# Altium schematic sheet PATHOS_FPGA_IO.SchDoc: FPGA IO
size A3; Author: A. Kalberer; CompanyName: NTB; Organization: NTB Interstate University of Applied; Address1: Werdenbergstrasse 4; Address3: 9471 Buchs; Address4: Switzerland; Organization1: Sciences of Technology Buchs; Size: A3
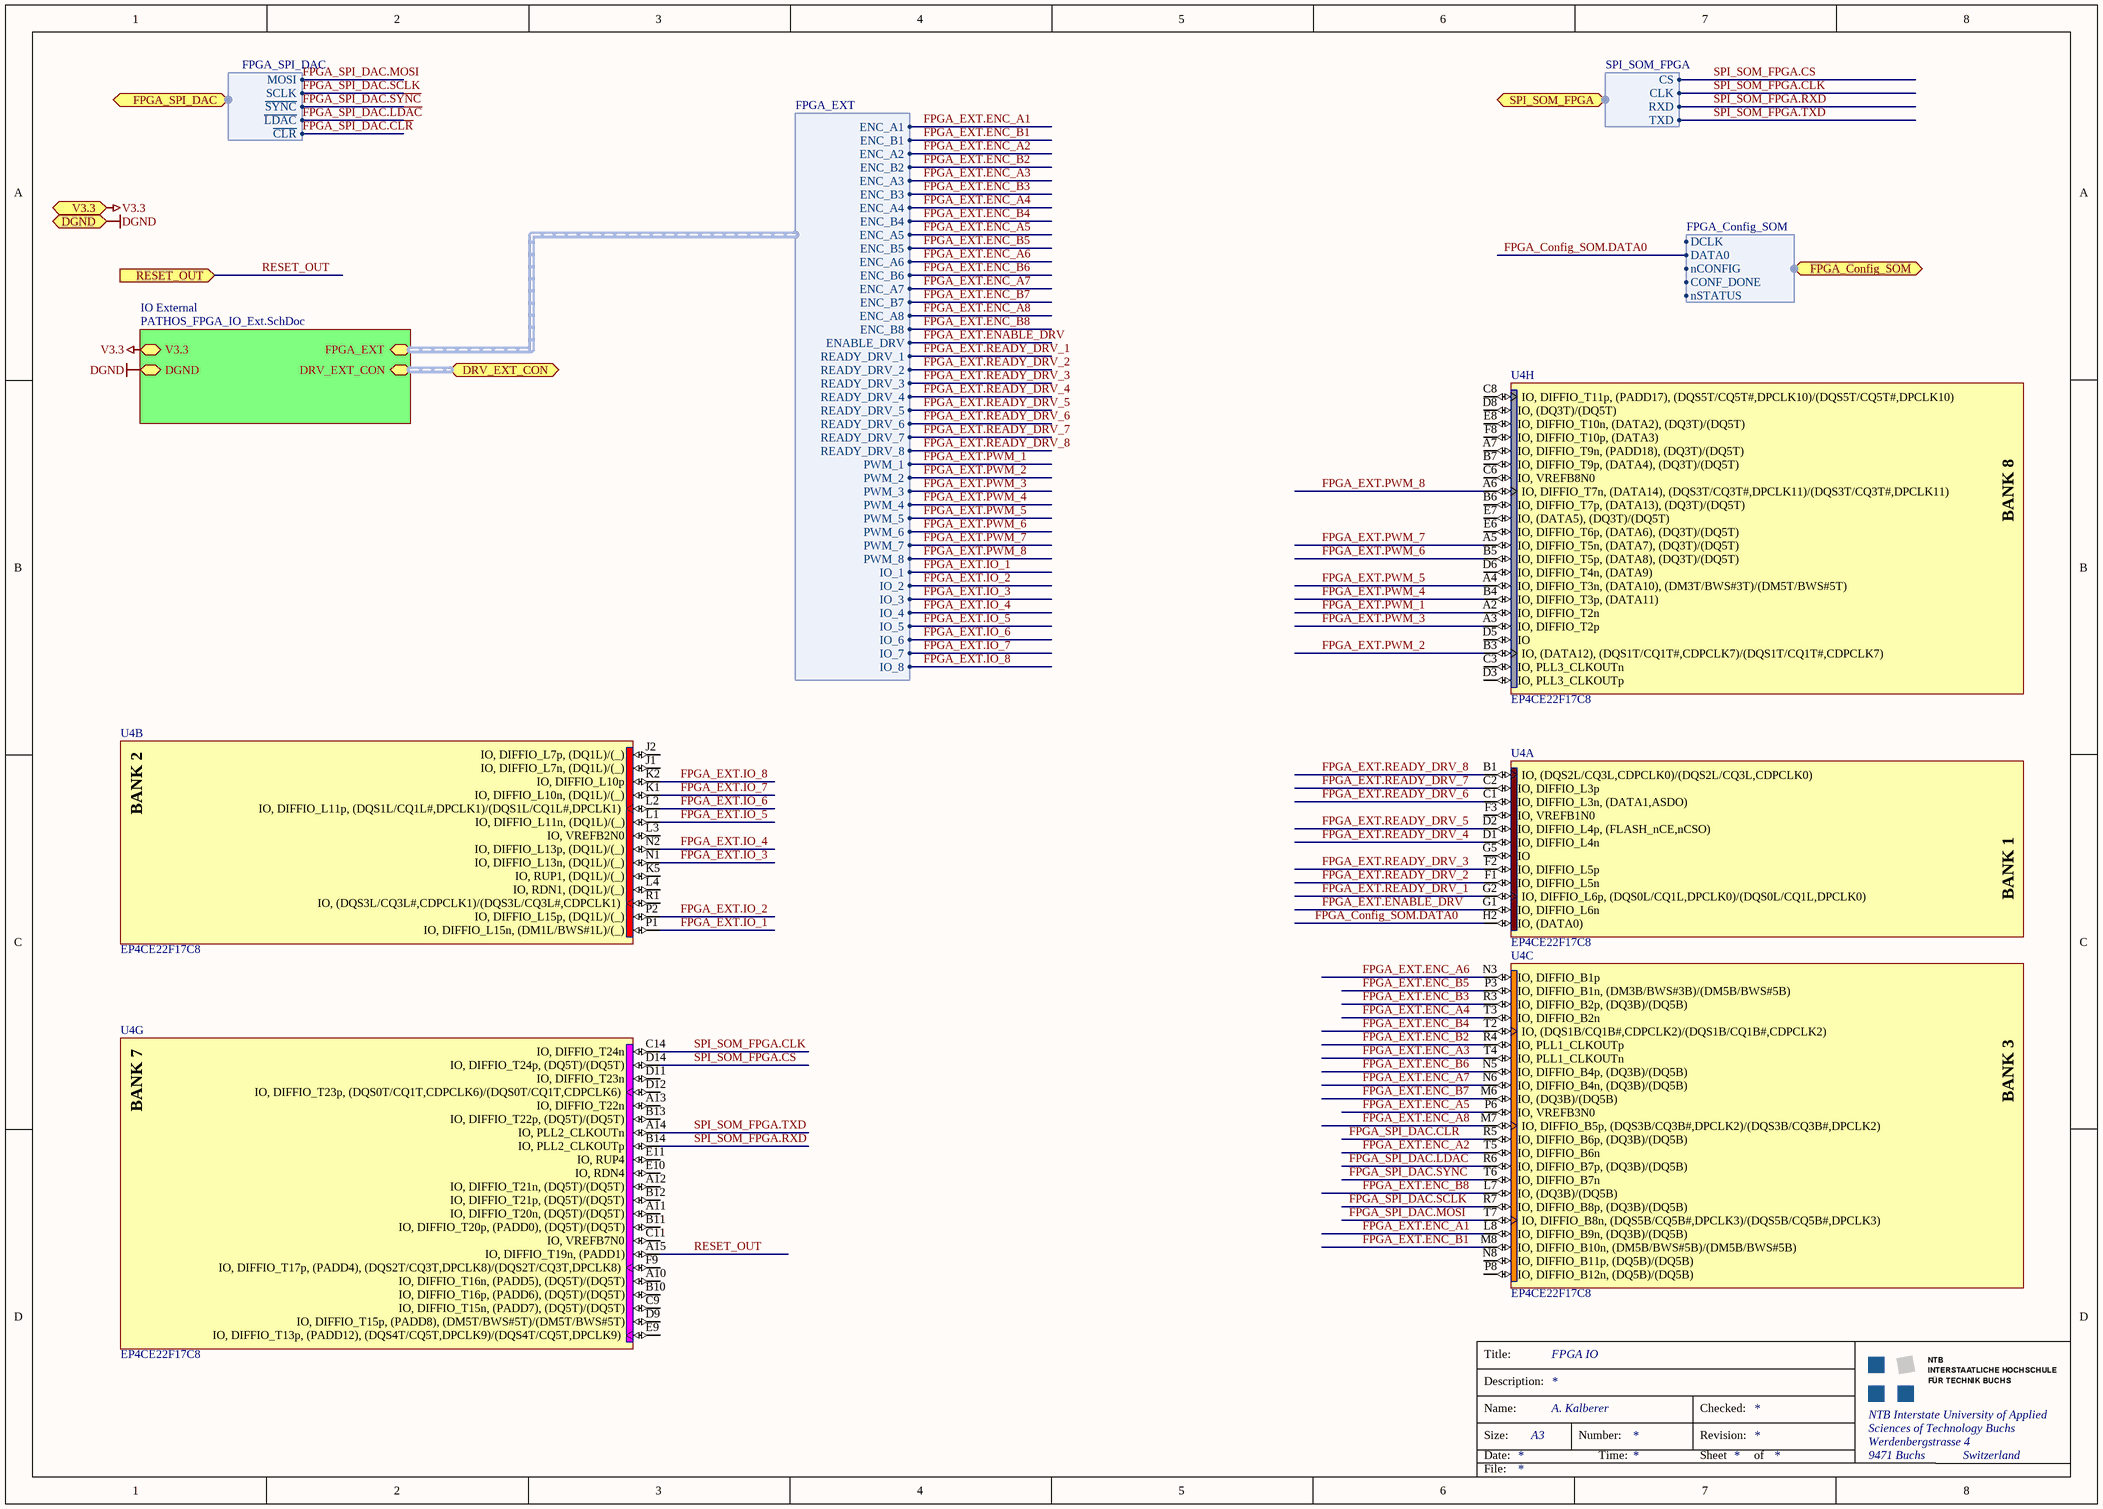
[diagram p0: PATHOS_FPGA_IO.SchDoc]

## Parts
U4  EP4CE22F17C8  [FBGA256]  (parts A,B,C,G,H of 13)

## Sub-sheets
IO External = PATHOS_FPGA_IO_Ext.SchDoc: V3.3, DGND, FPGA_EXT (harness FPGA_EXT), DRV_EXT_CON (harness DRV_EXT_CON)

## Ports
DGND, DRV_EXT_CON (harness DRV_EXT_CON), FPGA_Config_SOM (harness FPGA_Config_SOM), FPGA_SPI_DAC (harness FPGA_SPI_DAC), RESET_OUT (in), SPI_SOM_FPGA (harness SPI_SOM_FPGA), V3.3

## Harnesses
SPI_SOM_FPGA: CS, CLK, RXD, TXD
FPGA_Config_SOM: DCLK, DATA0, nCONFIG, CONF_DONE, nSTATUS
FPGA_SPI_DAC: MOSI, SCLK, ~{SYNC}, ~{LDAC}, ~{CLR}
FPGA_EXT: ENC_A1, ENC_B1, ENC_A2, ENC_B2, ENC_A3, ENC_B3, ENC_A4, ENC_B4, PWM_1, ENABLE_DRV, READY_DRV_4, READY_DRV_3, READY_DRV_2, READY_DRV_1, IO_1, IO_2, ENC_A5, ENC_B5, ENC_A6, ENC_B6, ENC_A7, ENC_B7, ENC_A8, ENC_B8, READY_DRV_5, READY_DRV_6, READY_DRV_7, READY_DRV_8, PWM_2, PWM_3, PWM_4, PWM_5, PWM_6, PWM_7, PWM_8, IO_3, IO_4, IO_5, IO_6, IO_7, IO_8

## Nets
DGND: port DGND, sheet IO External/DGND
V3.3: port V3.3, sheet IO External/V3.3
FPGA_Config_SOM.DATA0: U4.H2(IO,_(DATA0)) ; port FPGA_Config_SOM.DATA0
FPGA_EXT.ENABLE_DRV: U4.G1(IO,_DIFFIO_L6n) ; sheet IO External/FPGA_EXT.ENABLE_DRV
FPGA_EXT.ENC_A1: U4.L8(IO,_DIFFIO_B9n,_(DQ3B)/(DQ5B)) ; sheet IO External/FPGA_EXT.ENC_A1
FPGA_EXT.ENC_A2: U4.T5(IO,_DIFFIO_B6n) ; sheet IO External/FPGA_EXT.ENC_A2
FPGA_EXT.ENC_A3: U4.T4(IO,_PLL1_CLKOUTn) ; sheet IO External/FPGA_EXT.ENC_A3
FPGA_EXT.ENC_A4: U4.T3(IO,_DIFFIO_B2n) ; sheet IO External/FPGA_EXT.ENC_A4
FPGA_EXT.ENC_A5: U4.P6(IO,_VREFB3N0) ; sheet IO External/FPGA_EXT.ENC_A5
FPGA_EXT.ENC_A6: U4.N3(IO,_DIFFIO_B1p) ; sheet IO External/FPGA_EXT.ENC_A6
FPGA_EXT.ENC_A7: U4.N6(IO,_DIFFIO_B4n,_(DQ3B)/(DQ5B)) ; sheet IO External/FPGA_EXT.ENC_A7
FPGA_EXT.ENC_A8: U4.M7(IO,_DIFFIO_B5p,_(DQS3B/CQ3B#,DPCLK2)/(DQS3B/CQ3B#,DPCLK2)) ; sheet IO External/FPGA_EXT.ENC_A8
FPGA_EXT.ENC_B1: U4.M8(IO,_DIFFIO_B10n,_(DM5B/BWS#5B)/(DM5B/BWS#5B)) ; sheet IO External/FPGA_EXT.ENC_B1
FPGA_EXT.ENC_B2: U4.R4(IO,_PLL1_CLKOUTp) ; sheet IO External/FPGA_EXT.ENC_B2
FPGA_EXT.ENC_B3: U4.R3(IO,_DIFFIO_B2p,_(DQ3B)/(DQ5B)) ; sheet IO External/FPGA_EXT.ENC_B3
FPGA_EXT.ENC_B4: U4.T2(IO,_(DQS1B/CQ1B#,CDPCLK2)/(DQS1B/CQ1B#,CDPCLK2)) ; sheet IO External/FPGA_EXT.ENC_B4
FPGA_EXT.ENC_B5: U4.P3(IO,_DIFFIO_B1n,_(DM3B/BWS#3B)/(DM5B/BWS#5B)) ; sheet IO External/FPGA_EXT.ENC_B5
FPGA_EXT.ENC_B6: U4.N5(IO,_DIFFIO_B4p,_(DQ3B)/(DQ5B)) ; sheet IO External/FPGA_EXT.ENC_B6
FPGA_EXT.ENC_B7: U4.M6(IO,_(DQ3B)/(DQ5B)) ; sheet IO External/FPGA_EXT.ENC_B7
FPGA_EXT.ENC_B8: U4.L7(IO,_(DQ3B)/(DQ5B)) ; sheet IO External/FPGA_EXT.ENC_B8
FPGA_EXT.IO_1: U4.P1(IO,_DIFFIO_L15n,_(DM1L/BWS#1L)/(_)) ; sheet IO External/FPGA_EXT.IO_1
FPGA_EXT.IO_2: U4.P2(IO,_DIFFIO_L15p,_(DQ1L)/(_)) ; sheet IO External/FPGA_EXT.IO_2
FPGA_EXT.IO_3: U4.N1(IO,_DIFFIO_L13n,_(DQ1L)/(_)) ; sheet IO External/FPGA_EXT.IO_3
FPGA_EXT.IO_4: U4.N2(IO,_DIFFIO_L13p,_(DQ1L)/(_)) ; sheet IO External/FPGA_EXT.IO_4
FPGA_EXT.IO_5: U4.L1(IO,_DIFFIO_L11n,_(DQ1L)/(_)) ; sheet IO External/FPGA_EXT.IO_5
FPGA_EXT.IO_6: U4.L2(IO,_DIFFIO_L11p,_(DQS1L/CQ1L#,DPCLK1)/(DQS1L/CQ1L#,DPCLK1)) ; sheet IO External/FPGA_EXT.IO_6
FPGA_EXT.IO_7: U4.K1(IO,_DIFFIO_L10n,_(DQ1L)/(_)) ; sheet IO External/FPGA_EXT.IO_7
FPGA_EXT.IO_8: U4.K2(IO,_DIFFIO_L10p) ; sheet IO External/FPGA_EXT.IO_8
FPGA_EXT.PWM_1: U4.A2(IO,_DIFFIO_T2n) ; sheet IO External/FPGA_EXT.PWM_1
FPGA_EXT.PWM_2: U4.B3(IO,_(DATA12),_(DQS1T/CQ1T#,CDPCLK7)/(DQS1T/CQ1T#,CDPCLK7)) ; sheet IO External/FPGA_EXT.PWM_2
FPGA_EXT.PWM_3: U4.A3(IO,_DIFFIO_T2p) ; sheet IO External/FPGA_EXT.PWM_3
FPGA_EXT.PWM_4: U4.B4(IO,_DIFFIO_T3p,_(DATA11)) ; sheet IO External/FPGA_EXT.PWM_4
FPGA_EXT.PWM_5: U4.A4(IO,_DIFFIO_T3n,_(DATA10),_(DM3T/BWS#3T)/(DM5T/BWS#5T)) ; sheet IO External/FPGA_EXT.PWM_5
FPGA_EXT.PWM_6: U4.B5(IO,_DIFFIO_T5p,_(DATA8),_(DQ3T)/(DQ5T)) ; sheet IO External/FPGA_EXT.PWM_6
FPGA_EXT.PWM_7: U4.A5(IO,_DIFFIO_T5n,_(DATA7),_(DQ3T)/(DQ5T)) ; sheet IO External/FPGA_EXT.PWM_7
FPGA_EXT.PWM_8: U4.A6(IO,_DIFFIO_T7n,_(DATA14),_(DQS3T/CQ3T#,DPCLK11)/(DQS3T/CQ3T#,DPCLK11)) ; sheet IO External/FPGA_EXT.PWM_8
FPGA_EXT.READY_DRV_1: U4.G2(IO,_DIFFIO_L6p,_(DQS0L/CQ1L,DPCLK0)/(DQS0L/CQ1L,DPCLK0)) ; sheet IO External/FPGA_EXT.READY_DRV_1
FPGA_EXT.READY_DRV_2: U4.F1(IO,_DIFFIO_L5n) ; sheet IO External/FPGA_EXT.READY_DRV_2
FPGA_EXT.READY_DRV_3: U4.F2(IO,_DIFFIO_L5p) ; sheet IO External/FPGA_EXT.READY_DRV_3
FPGA_EXT.READY_DRV_4: U4.D1(IO,_DIFFIO_L4n) ; sheet IO External/FPGA_EXT.READY_DRV_4
FPGA_EXT.READY_DRV_5: U4.D2(IO,_DIFFIO_L4p,_(FLASH_nCE,nCSO)) ; sheet IO External/FPGA_EXT.READY_DRV_5
FPGA_EXT.READY_DRV_6: U4.C1(IO,_DIFFIO_L3n,_(DATA1,ASDO)) ; sheet IO External/FPGA_EXT.READY_DRV_6
FPGA_EXT.READY_DRV_7: U4.C2(IO,_DIFFIO_L3p) ; sheet IO External/FPGA_EXT.READY_DRV_7
FPGA_EXT.READY_DRV_8: U4.B1(IO,_(DQS2L/CQ3L,CDPCLK0)/(DQS2L/CQ3L,CDPCLK0)) ; sheet IO External/FPGA_EXT.READY_DRV_8
FPGA_SPI_DAC.~{CLR}: U4.R5(IO,_DIFFIO_B6p,_(DQ3B)/(DQ5B)) ; port FPGA_SPI_DAC.~{CLR}
FPGA_SPI_DAC.~{LDAC}: U4.R6(IO,_DIFFIO_B7p,_(DQ3B)/(DQ5B)) ; port FPGA_SPI_DAC.~{LDAC}
FPGA_SPI_DAC.MOSI: U4.T7(IO,_DIFFIO_B8n,_(DQS5B/CQ5B#,DPCLK3)/(DQS5B/CQ5B#,DPCLK3)) ; port FPGA_SPI_DAC.MOSI
FPGA_SPI_DAC.~{SYNC}: U4.T6(IO,_DIFFIO_B7n) ; port FPGA_SPI_DAC.~{SYNC}
FPGA_SPI_DAC.SCLK: U4.R7(IO,_DIFFIO_B8p,_(DQ3B)/(DQ5B)) ; port FPGA_SPI_DAC.SCLK
RESET_OUT: U4.A15(IO,_DIFFIO_T19n,_(PADD1)) ; port RESET_OUT
SPI_SOM_FPGA.CLK: U4.C14(IO,_DIFFIO_T24n) ; port SPI_SOM_FPGA.CLK
SPI_SOM_FPGA.CS: U4.D14(IO,_DIFFIO_T24p,_(DQ5T)/(DQ5T)) ; port SPI_SOM_FPGA.CS
SPI_SOM_FPGA.RXD: U4.B14(IO,_PLL2_CLKOUTp) ; port SPI_SOM_FPGA.RXD
SPI_SOM_FPGA.TXD: U4.A14(IO,_PLL2_CLKOUTn) ; port SPI_SOM_FPGA.TXD

Not connected (* = marked no-connect by the designer): U4 A7(IO,_DIFFIO_T9n,_(PADD18),_(DQ3T)/(DQ5T)) A10(IO,_DIFFIO_T16n,_(PADD5),_(DQ5T)/(DQ5T)) A11(IO,_DIFFIO_T20n,_(DQ5T)/(DQ5T)) A12(IO,_DIFFIO_T21n,_(DQ5T)/(DQ5T)) A13(IO,_DIFFIO_T22n) B6(IO,_DIFFIO_T7p,_(DATA13),_(DQ3T)/(DQ5T)) B7(IO,_DIFFIO_T9p,_(DATA4),_(DQ3T)/(DQ5T)) B10(IO,_DIFFIO_T16p,_(PADD6),_(DQ5T)/(DQ5T)) B11(IO,_DIFFIO_T20p,_(PADD0),_(DQ5T)/(DQ5T)) B12(IO,_DIFFIO_T21p,_(DQ5T)/(DQ5T)) B13(IO,_DIFFIO_T22p,_(DQ5T)/(DQ5T)) C3(IO,_PLL3_CLKOUTn) C6(IO,_VREFB8N0) C8(IO,_DIFFIO_T11p,_(PADD17),_(DQS5T/CQ5T#,DPCLK10)/(DQS5T/CQ5T#,DPCLK10)) C9(IO,_DIFFIO_T15n,_(PADD7),_(DQ5T)/(DQ5T)) C11(IO,_VREFB7N0) D3(IO,_PLL3_CLKOUTp) D5(IO) D6(IO,_DIFFIO_T4n,_(DATA9)) D8(IO,_(DQ3T)/(DQ5T)) D9(IO,_DIFFIO_T15p,_(PADD8),_(DM5T/BWS#5T)/(DM5T/BWS#5T)) D11(IO,_DIFFIO_T23n) D12(IO,_DIFFIO_T23p,_(DQS0T/CQ1T,CDPCLK6)/(DQS0T/CQ1T,CDPCLK6)) E6(IO,_DIFFIO_T6p,_(DATA6),_(DQ3T)/(DQ5T)) E7(IO,_(DATA5),_(DQ3T)/(DQ5T)) E8(IO,_DIFFIO_T10n,_(DATA2),_(DQ3T)/(DQ5T)) E9(IO,_DIFFIO_T13p,_(PADD12),_(DQS4T/CQ5T,DPCLK9)/(DQS4T/CQ5T,DPCLK9)) E10(IO,_RDN4) E11(IO,_RUP4) F3(IO,_VREFB1N0) F8(IO,_DIFFIO_T10p,_(DATA3)) F9(IO,_DIFFIO_T17p,_(PADD4),_(DQS2T/CQ3T,DPCLK8)/(DQS2T/CQ3T,DPCLK8)) G5(IO) J1(IO,_DIFFIO_L7n,_(DQ1L)/(_)) J2(IO,_DIFFIO_L7p,_(DQ1L)/(_)) K5(IO,_RUP1,_(DQ1L)/(_)) L3(IO,_VREFB2N0) L4(IO,_RDN1,_(DQ1L)/(_)) N8(IO,_DIFFIO_B11p,_(DQ5B)/(DQ5B)) P8(IO,_DIFFIO_B12n,_(DQ5B)/(DQ5B)) R1(IO,_(DQS3L/CQ3L#,CDPCLK1)/(DQS3L/CQ3L#,CDPCLK1))

## Buses and harness runs
harness port DRV_EXT_CON = sheet IO External/DRV_EXT_CON

## Notes on the sheet
- Title:
- Description:
- Size:
- Date:
- Name:
- Number:
- Time:
- Revision:
- Sheet
- Checked:
- of
- File:
- (in symbol EP4CE22F17C8, part A) BANK 1
- (in symbol EP4CE22F17C8, part B) BANK 2
- (in symbol EP4CE22F17C8, part C) BANK 3
- (in symbol EP4CE22F17C8, part G) BANK 7
- (in symbol EP4CE22F17C8, part H) BANK 8

## Library data of the parts
U4 = EP4CE22F17C8: Cyclone IV Family FPGA, 2V Core, 153 I/O Pins, 4 PLLs, 256-Pin FBGA, Speed Grade 8, Commercial Grade; Published: 3-May-2010; DatasheetVersion: ver1.2, Mar-2010; PackageVersion: ver16.0, Dec-2009; PackageReference: FBGA256; Publisher: Altium Limited; PackageDescription: 256-Ball FineLine Ball Grid Array (FBGA256) - Option 1 - Wire Bond; Supplier 1: Digi-Key; Supplier Part Number 1: EP4CE22F17C8-ND; Code_JEDEC: MS-034-AAF-1; Code_IPC: BGA100P16X16-256; ComponentLink1Description: Manufacturer Link; ComponentLink1URL: http://www.altera.com/; ComponentLink2Description: Handbook; ComponentLink2URL: http://www.altera.com/literature/hb/cyclone-iv/cyclone4-handbook.pdf; ComponentLink3Description: Pinout Specification; ComponentLink3URL: http://www.altera.com/literature/lit-dp.jsp?category=cyc%204&showspreadsheet=y; ComponentLink4Description: Packaging Specification; ComponentLink4URL: http://www.altera.com/literature/ds/dspkg.pdf